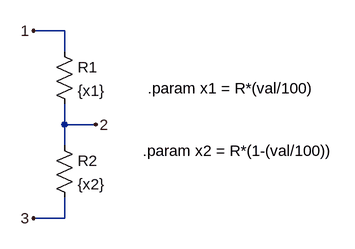
[diagram p0: schematic pot.asc]
pot.asc, the LTspice schematic file:
Version 4.1
SHEET 1 880 680
WIRE 192 32 144 32
WIRE 192 64 192 32
WIRE 192 176 192 144
WIRE 240 176 192 176
WIRE 192 208 192 176
WIRE 192 320 192 288
WIRE 192 320 144 320
FLAG 144 32 1
FLAG 240 176 2
FLAG 144 320 3
SYMBOL res 176 48 R0
SYMATTR InstName R1
SYMATTR Value {x1}
SYMBOL res 176 192 R0
SYMATTR InstName R2
SYMATTR Value {x2}
TEXT 320 120 Left 2 !.param x1 = R*(val/100)
TEXT 312 216 Left 2 !.param x2 = R*(1-(val/100))

The netlist it stands for:
* pot.asc
R1 1 2 {x1}
R2 2 3 {x2}
.param x1 = R*(val/100)
.param x2 = R*(1-(val/100))
.backanno
.end